# Altium project SolarChargeController.PrjPcb
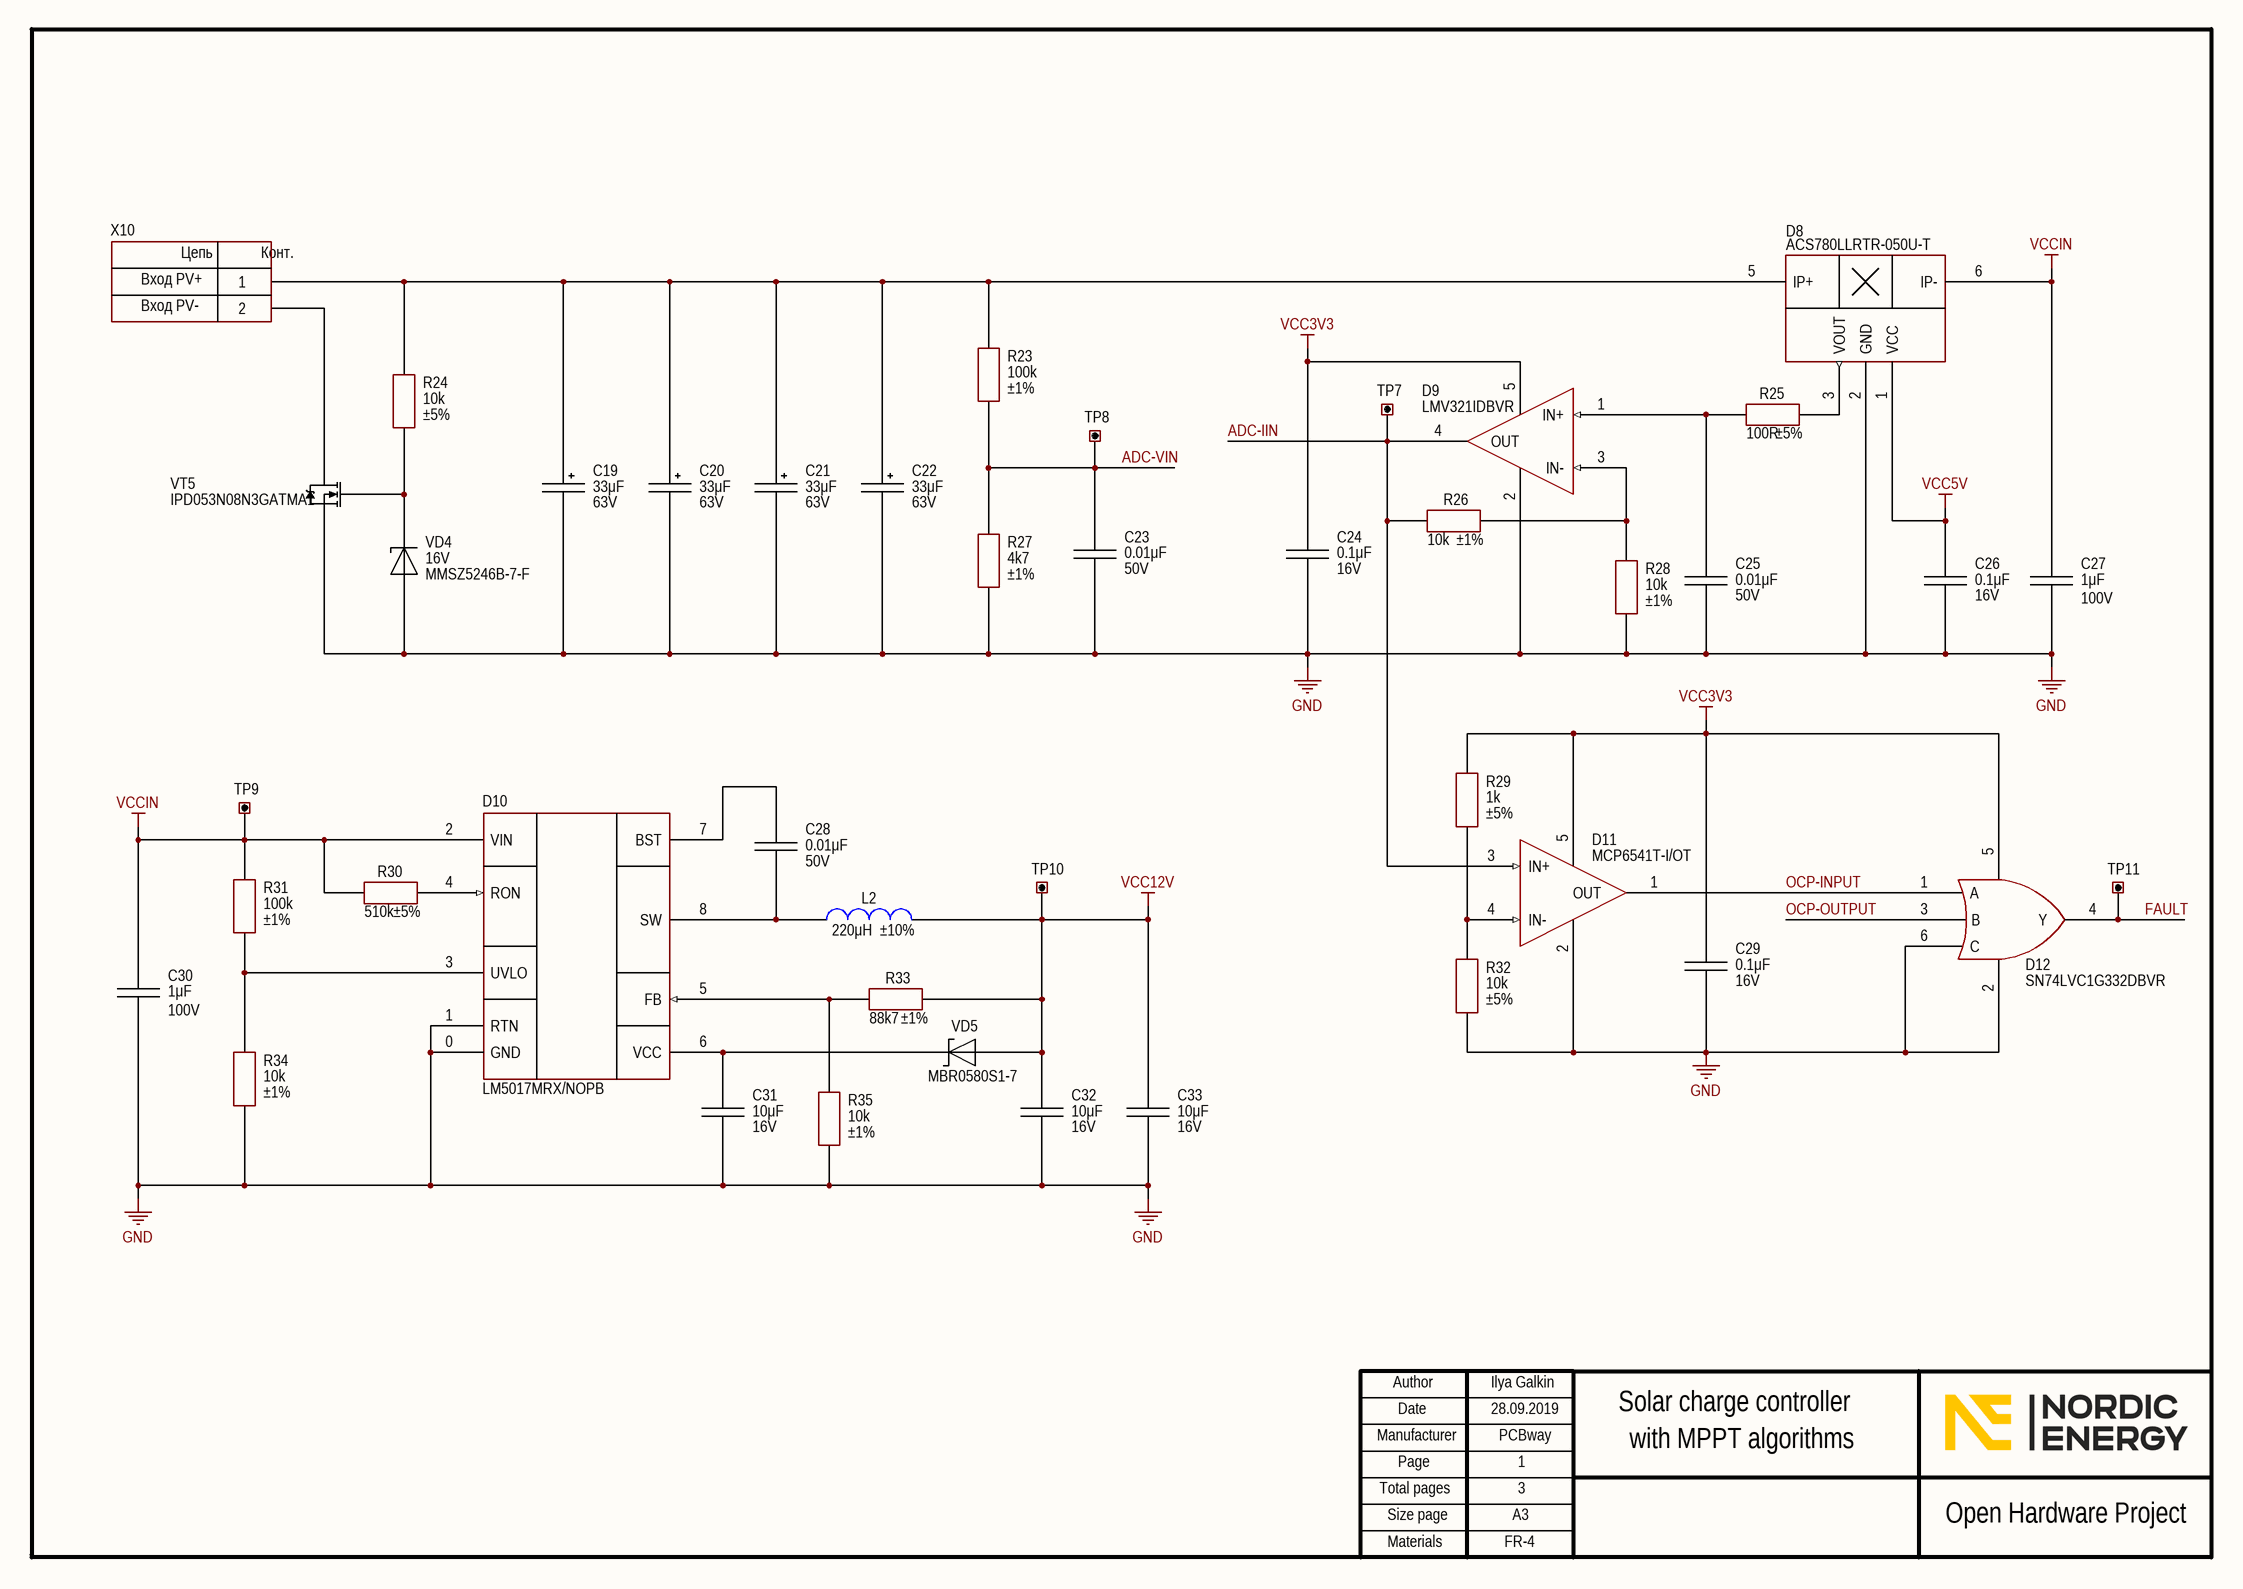
[diagram p0: InputCircuitsAndSupply.SchDoc]
3 sheets, 113 parts. Net scope: global (net labels, ports and power ports of the same name join across sheets).
Board file: PcbForChargeController.PcbDoc
Sheets:
  InputCircuitsAndSupply.SchDoc
  BuckAndOutputCircuits. Page 2.SchDoc
  InterfaceAndControl.SchDoc

## Sheet InputCircuitsAndSupply.SchDoc
size 420 x 297 mm; Address1: Address1; Address2: Address2; Address3: Address3; Address4: Address4; DocumentNumber: АБВГ.123456.001 Э3; SheetNumber: 1; SheetTotal: 3; Scale: 1:1; DocumentType: Схема электрическая принципиальная; FirstReferrence: АБВГ.123456.001

### Parts
C19  value 33μF  Voltage: 63V  [CAP: D8C3.5H12]
C20  value 33μF  Voltage: 63V  [CAP: D8C3.5H12]
C21  value 33μF  Voltage: 63V  [CAP: D8C3.5H12]
C22  value 33μF  Voltage: 63V  [CAP: D8C3.5H12]
C23  value 0.01μF  Voltage: 50V  [CAP: 0805]
C24  value 0.1μF  Voltage: 16V  [CAP: 0805]
C25  value 0.01μF  Voltage: 50V  [CAP: 0805]
C26  value 0.1μF  Voltage: 16V  [CAP: 0805]
C27  value 1μF  Voltage: 100V  [CAP: 1206]
C28  value 0.01μF  Voltage: 50V  [CAP: 0805]
C29  value 0.1μF  Voltage: 16V  [CAP: 0805]
C30  value 1μF  Voltage: 100V  [CAP: 1206]
C31  value 10μF  Voltage: 16V  [CAP: 0805]
C32  value 10μF  Voltage: 16V  [CAP: 0805]
C33  value 10μF  Voltage: 16V  [CAP: 0805]
D8  PartNumber: ACS780LLRTR-050U-T  [SENSOR: ACS781]
D9  (no value)  [SOT23-5]
D10  PartNumber: LM5017MRX/NOPB  [8-SOIC-PAD]
D11  (no value)  [SOT23-5]
D12  (no value)  [SOT23-6]
L2  value 220μH  Tolerance: ±10%  [IND: SDR0805]
R23  value 100k  Tolerance: ±1%  [RES: 0805]
R24  value 10k  Tolerance: ±5%  [RES: 0805]
R25  value 100R  Tolerance: ±5%  [RES: 0805]
R26  value 10k  Tolerance: ±1%  [RES: 0805]
R27  value 4k7  Tolerance: ±1%  [RES: 0805]
R28  value 10k  Tolerance: ±1%  [RES: 0805]
R29  value 1k  Tolerance: ±5%  [RES: 0805]
R30  value 510k  Tolerance: ±5%  [RES: 0805]
R31  value 100k  Tolerance: ±1%  [RES: 0805]
R32  value 10k  Tolerance: ±5%  [RES: 0805]
R33  value 88k7  Tolerance: ±1%  [RES: 0805]
R34  value 10k  Tolerance: ±1%  [RES: 0805]
R35  value 10k  Tolerance: ±1%  [RES: 0805]
TP7  (no value)  [CON: 5004 (Keystone)]
TP8  (no value)  [CON: 5004 (Keystone)]
TP9  (no value)  [CON: 5001 (Keystone)]
TP10  (no value)  [CON: 5001 (Keystone)]
TP11  (no value)  [CON: 5001 (Keystone)]
VD4  Voltage: 16V  PartNumber: MMSZ5246B-7-F  [DIODE: SOD123]
VD5  PartNumber: MBR0580S1-7  [DIODE: SOD123]
VT5  PartNumber: IPD053N08N3GATMA1  [DPAK]
X10  (no value)  [CON: 6PCV-02-006]

### Nets
GND: C19.2 C20.2 C21.2 C22.2 C23.1 C24.1 C25.1 C26.1 C27.1 C29.1 C30.1 C31.1 C32.1 C33.1 D8.2(GND) D9.2(V-) D10.0(GND) D10.1(RTN) D11.2(V-) D12.2 D12.6(C) R27.2 R28.2 R32.2 R34.2 R35.2 VD4.1(A) VT5.2(S)
VCC3V3: C24.2 C29.2 D9.5(V+) D11.5(V+) D12.5 R29.1
VCC5V: C26.2 D8.1(VCC)
VCC12V: C32.2 C33.2 L2.1 R33.2 TP10.1 VD5.1
VCCIN: C27.2 C30.2 D8.6(IP-) D10.2(VIN) R30.1 R31.2 TP9.1
ADC-IIN: D9.4(OUT) D11.3(IN+) R26.1 TP7.1
ADC-VIN: C23.2 R23.2 R27.1 TP8.1
FAULT: D12.4(Y) TP11.1
OCP-INPUT: D11.1(OUT) D12.1(A)
OCP-OUTPUT: D12.3(B)
NetC19_1: C19.1 C20.1 C21.1 C22.1 D8.5(IP+) R23.1 R24.1 X10.1
NetC25_2: C25.2 D9.1(IN+) R25.1
NetC28_1: C28.1 D10.8(SW) L2.2
NetC28_2: C28.2 D10.7(BST)
NetC31_2: C31.2 D10.6(VCC) VD5.2
NetD8_3: D8.3(VOUT) R25.2
NetD9_3: D9.3(IN-) R26.2 R28.1
NetD10_3: D10.3(UVLO) R31.1 R34.1
NetD10_4: D10.4(RON) R30.2
NetD10_5: D10.5(FB) R33.1 R35.1
NetD11_4: D11.4(IN-) R29.2 R32.1
NetR24_2: R24.2 VD4.2(C) VT5.1(G)
NetVT5_3: VT5.3(D) X10.2

### Notes on the sheet
- Вход PV+
- Вход PV-
- Ilya Galkin
- 28.09.2019
- PCBway
- 1
- Solar charge controller
- with MPPT algorithms
- 3
- FR-4
- Author
- Manufacturer
- Date
- Page
- Total pages
- Size page
- A3
- Open Hardware Project
- Materials
- (in symbol Connector_6PCV-02) Цепь; Конт.

### Library data of the parts
C19-C22 = Aluminium: Manufacturer: Panasonic; PartNumber: 63SXE33M; ValueManufacturerPartNumber: Aluminium capacitor, 33μF, 63V, ±20%, 25mOhm, 12x8x3.5 mm, -55...+105°C; TypeCapacitor: Aluminium capacitor; Tolerance: ±20%; Impedance: 25mOhm; Package: 12x8x3.5 mm; HelpURL: https://www.digikey.com/products/en?keywords=%2063SXE33M; Temperature: -55...+105°C
C23 C25 C28 = Ceramic_0805: Manufacturer: Yageo; PartNumber: CC0805KRX7R9BB103; ValueManufacturerPartNumber: Ceramic capacitor, 0.01μF, X7R, ±10%, 50V, 0805, -55...+125°C; TypeCapacitor: Ceramic capacitor; Tolerance: ±10%; TypeDielectric: X7R; Package: 0805; HelpURL: https://www.digikey.com/product-detail/en/yageo/CC0805KRX7R9BB103/311-1136-1-ND/303046; Temperature: -55...+125°C
C24 C26 C29 = Ceramic_0805: Manufacturer: Yageo; PartNumber: CC0805KRX7R7BB104; ValueManufacturerPartNumber: Ceramic capacitor, 0.1μF, X7R, ±10%, 16V, 0805, -55...+125°C; TypeCapacitor: Ceramic capacitor; Tolerance: ±10%; TypeDielectric: X7R; Package: 0805; HelpURL: https://www.digikey.com/product-detail/en/yageo/CC0805KRX7R7BB104/311-1142-1-ND/303052; Temperature: -55...+125°C
C27 C30 = Ceramic_1206: Manufacturer: Samsung; PartNumber: CL31B105KCHNNNE; ValueManufacturerPartNumber: Ceramic capacitor, 1μF, X7R, ±10%, 100V, 1206, -55...+125°C; TypeCapacitor: Ceramic capacitor; Tolerance: ±10%; TypeDielectric: X7R; Package: 1206; HelpURL: https://www.digikey.com/product-detail/en/samsung-electro-mechanics/CL31B105KCHNNNE/1276-1838-1-ND/3889924; Temperature: -55...+125°C
C31-C33 = Ceramic_0805: Manufacturer: Samsung; PartNumber: CL21B106KOQNNNG; ValueManufacturerPartNumber: Ceramic capacitor, 10μF, X7R, ±10%, 16V, 0805, -55...+125°C; TypeCapacitor: Ceramic capacitor; Tolerance: ±10%; TypeDielectric: X7R; Package: 0805; HelpURL: https://www.digikey.com/product-detail/en/samsung-electro-mechanics/CL21B106KOQNNNG/1276-6472-1-ND/5958100; Temperature: -55...+125°C
D8 = ACS780: Current sensors; Manufacturer: Allegro MicroSystems; ValueManufacturerPartNumber: IC current sensors, 50A, ±1.5%, 120 kHz, 60mV/A, -40...+150°C, 7-PSOF; Supply: 4.5...5.5V; Accuracy: ±1.5%; GainBandwidth: 120 kHz; Sensitivity: 60mV/A; Sensing: 50A; HelpURL: https://www.digikey.com/product-detail/en/allegro-microsystems-llc/ACS780LLRTR-050U-T/620-1818-1-ND/6189107; Package: 7-PSOF; ComponentType: IC current sensors; Temperature: -40...+150°C
D9 = LMV321IDBVR: OP amplifier; Manufacturer: Texas Instruments; ValueManufacturerPartNumber: IC op amplifier, Rail-to-Rail, 1 MHz, 2.7...5.5V, -40...+125°C, SOT23-5; Supply: 2.7...5.5V; OutputType: Rail-to-Rail; GainBandwidth: 1 MHz; HelpURL: https://www.digikey.com/product-detail/en/texas-instruments/LMV321IDBVR/296-9567-1-ND/379849; Package: SOT23-5; ComponentType: IC op amplifier; Temperature: -40...+125°C; PartNumber: LMV321IDBVR
D10 = LM5017MRX: Buck converter; Manufacturer: Texas Instruments; ValueManufacturerPartNumber: DC/DC buck converter, input 7.5...100V, 1MHz, output 1.225...90V, 0.6A, -40...+125°C, 8-SOIC; VoltageInput: input 7.5...100V; Frequency: 1MHz; CurrentOutput: 0.6A; VoltageOutput: output 1.225...90V; HelpURL: https://www.digikey.com/product-detail/en/texas-instruments/LM5017SD-NOPB/LM5017SD-NOPBCT-ND/3137455; Package: 8-SOIC; ComponentType: DC/DC buck converter; Temperature: -40...+125°C
D11 = MCP6541T-I/OT: Comparator; Manufacturer: Microchip Technology; ValueManufacturerPartNumber: IC comparator, Rail-to-Rail, 1.6...5.5V, -40...+85°C, SOT23-5; Supply: 1.6...5.5V; OutputType: Rail-to-Rail; HelpURL: https://www.digikey.com/product-detail/en/microchip-technology/MCP6541T-I-OT/MCP6541T-I-OTCT-ND/3622387; Package: SOT23-5; ComponentType: IC comparator; Temperature: -40...+85°C; PartNumber: MCP6541T-I/OT
D12 = SN74LVC1G332DBVR: OR; Manufacturer: Texas Instruments; ValueManufacturerPartNumber: IC logic OR, 1.65...5.5V, -40...+125°C, SOT23-6; Supply: 1.65...5.5V; HelpURL: https://www.digikey.com/product-detail/en/texas-instruments/SN74LVC1G332DBVR/296-18587-1-ND/857355; Package: SOT23-6; ComponentType: IC logic OR; Temperature: -40...+125°C; PartNumber: SN74LVC1G332DBVR
L2 = Inductor_SDR0805: Manufacturer: Bourns; PartNumber: SDR0805-221KL; ValueManufacturerPartNumber: Fixed inductor, 220μH, ±10%, SDR0805, 490mA, -40...+125°C; TypeInductor: Fixed inductor; MaxCurrent: 490mA; Package: SDR0805; HelpURL: https://www.digikey.com/product-detail/en/bourns-inc/SDR0805-221KL/SDR0805-221KLCT-ND/2127164; Temperature: -40...+125°C
R23 R31 = Resistor_0805: Manufacturer: Yageo; PartNumber: RC0805FR-07100KL; ValueManufacturerPartNumber: Resistor film, 100k, ±1%, 0805, 0.125W, -55...+125°C; TypeResistor: Resistor film; Power: 0.125W; Package: 0805; HelpURL: https://www.digikey.com/product-detail/en/yageo/RC0805FR-07100KL/311-100KCRCT-ND/730491; Temperature: -55...+125°C
R24 R32 = Resistor_0805: Manufacturer: Yageo; PartNumber: RC0805JR-0710KL; ValueManufacturerPartNumber: Resistor film, 10k, ±5%, 0805, 0.125W, -55...+125°C; TypeResistor: Resistor film; Power: 0.125W; Package: 0805; HelpURL: https://www.digikey.com/product-detail/en/yageo/RC0805JR-0710KL/311-10KARCT-ND/731188; Temperature: -55...+125°C
R25 = Resistor_0805: Manufacturer: Yageo; PartNumber: RC0805JR-07100RL; ValueManufacturerPartNumber: Resistor film, 100R, ±5%, 0805, 0.125W, -55...+125°C; TypeResistor: Resistor film; Power: 0.125W; Package: 0805; HelpURL: https://www.digikey.com/product-detail/en/yageo/RC0805JR-07100RL/311-100ARCT-ND/731185; Temperature: -55...+125°C
R26 R28 R34 R35 = Resistor_0805: Manufacturer: Yageo; PartNumber: RC0805FR-0710KL; ValueManufacturerPartNumber: Resistor film, 10k, ±1%, 0805, 0.125W, -55...+125°C; TypeResistor: Resistor film; Power: 0.125W; Package: 0805; HelpURL: https://www.digikey.com/product-detail/en/yageo/RC0805FR-0710KL/311-10.0KCRCT-ND/730482; Temperature: -55...+125°C
R27 = Resistor_0805: Manufacturer: Yageo; PartNumber: RC0805FR-074K7L; ValueManufacturerPartNumber: Resistor film, 4k7, ±1%, 0805, 0.125W, -55...+125°C; TypeResistor: Resistor film; Power: 0.125W; Package: 0805; HelpURL: https://www.digikey.com/product-detail/en/yageo/RC0805FR-074K7L/311-4.70KCRCT-ND/730876; Temperature: -55...+125°C
R29 = Resistor_0805: Manufacturer: Yageo; PartNumber: RC0805JR-071KL; ValueManufacturerPartNumber: Resistor film, 1k, ±5%, 0805, 0.125W, -55...+125°C; TypeResistor: Resistor film; Power: 0.125W; Package: 0805; HelpURL: https://www.digikey.com/product-detail/en/yageo/RC0805JR-071KL/311-1.0KARCT-ND/731165; Temperature: -55...+125°C
R30 = Resistor_0805: Manufacturer: Yageo; PartNumber: RC0805JR-07510KL; ValueManufacturerPartNumber: Resistor film, 510k, ±5%, 0805, 0.125W, -55...+125°C; TypeResistor: Resistor film; Power: 0.125W; Package: 0805; HelpURL: https://www.digikey.com/product-detail/en/yageo/RC0805JR-07510KL/311-510KARCT-ND/731291; Temperature: -55...+125°C
R33 = Resistor_0805: Manufacturer: Yageo; PartNumber: RC0805FR-0788K7L; ValueManufacturerPartNumber: Resistor film, 88k7, ±1%, 0805, 0.125W, -55...+125°C; TypeResistor: Resistor film; Power: 0.125W; Package: 0805; HelpURL: https://www.digikey.com/product-detail/en/yageo/RC0805FR-0788K7L/311-88.7KCRCT-ND/731128; Temperature: -55...+125°C
TP7-TP11 = Connector_Test_Point: Manufacturer: Keystone; ValueManufacturerPartNumber: Test point, Keystone, 5001; PartNumber: 5001; TypeConnector: Test point; HelpURL: https://www.digikey.com/product-detail/en/keystone-electronics/5001/36-5001-ND/255327
VD4 = Zener_single: Manufacturer: Diodes Incorporated; ValueManufacturerPartNumber: Zener diode, 16V, 500mW, 0.9V, 17Ohm, SOD-123, -65...+150°C; TypeDiode: Zener diode; Current: 500mW; VoltageDrop: 0.9V; RecoveryTime: 17Ohm; Package: SOD-123; HelpURL: https://www.digikey.com/product-detail/en/diodes-incorporated/MMSZ5246B-7-F/MMSZ5246B-FDICT-ND/717912; Temperature: -65...+150°C
VD5 = Schottky_single: Manufacturer: Diodes Incorporated; ValueManufacturerPartNumber: Schottky diode, 80V, 500mA, 1V, 15pF, SOD-123, -55...+150°C; TypeDiode: Schottky diode; Voltage: 80V; Current: 500mA; VoltageDrop: 1V; RecoveryTime: 15pF; Package: SOD-123; HelpURL: https://www.digikey.com/product-detail/en/diodes-incorporated/MBR0580S1-7/MBR0580S1-7DICT-ND/5080371; Temperature: -55...+150°C
VT5 = MOSFET_N_132: Manufacturer: Infineon Technologies; ValueManufacturerPartNumber: MOSFET N-channel transistor, 80V, 90A, 69nC, 150W, 5.3mOhm, 4750pF, Dpak, -55...+150°C; TypeTransistor: MOSFET N-channel transistor; VoltageDS: 80V; CurrentDS: 90A; RDS: 5.3mOhm; GateCharge: 69nC; InputCapacitor: 4750pF; MaxPower: 150W; Package: Dpak; HelpURL: https://www.digikey.com/product-detail/en/infineon-technologies/IPD053N08N3GATMA1/IPD053N08N3GATMA1CT-ND/5353500; Temperature: -55...+150°C
X10 = Connector_6PCV-02: Manufacturer: TE Connectivity; ValueManufacturerPartNumber: Connector, 2pin, 9.53mm, 300VAC, 25A; PartNumber: 6PCV-02-006; VoltageMax: 300VAC; Pitch: 9.53mm; CurrentMax: 25A; Multichannel: 2pin; CommentText: "Solar panel"; HelpURL: https://www.digikey.com/products/en?keywords=6PCV-02-006; TypeConnector: Connector

## Sheet BuckAndOutputCircuits. Page 2.SchDoc
size 420 x 297 mm; Address1: Address1; Address2: Address2; Address3: Address3; Address4: Address4; DocumentNumber: АБВГ.123456.001 Э3; SheetNumber: 2; SheetTotal: 3; Scale: 1:1; DocumentType: Схема электрическая принципиальная; FirstReferrence: АБВГ.123456.001
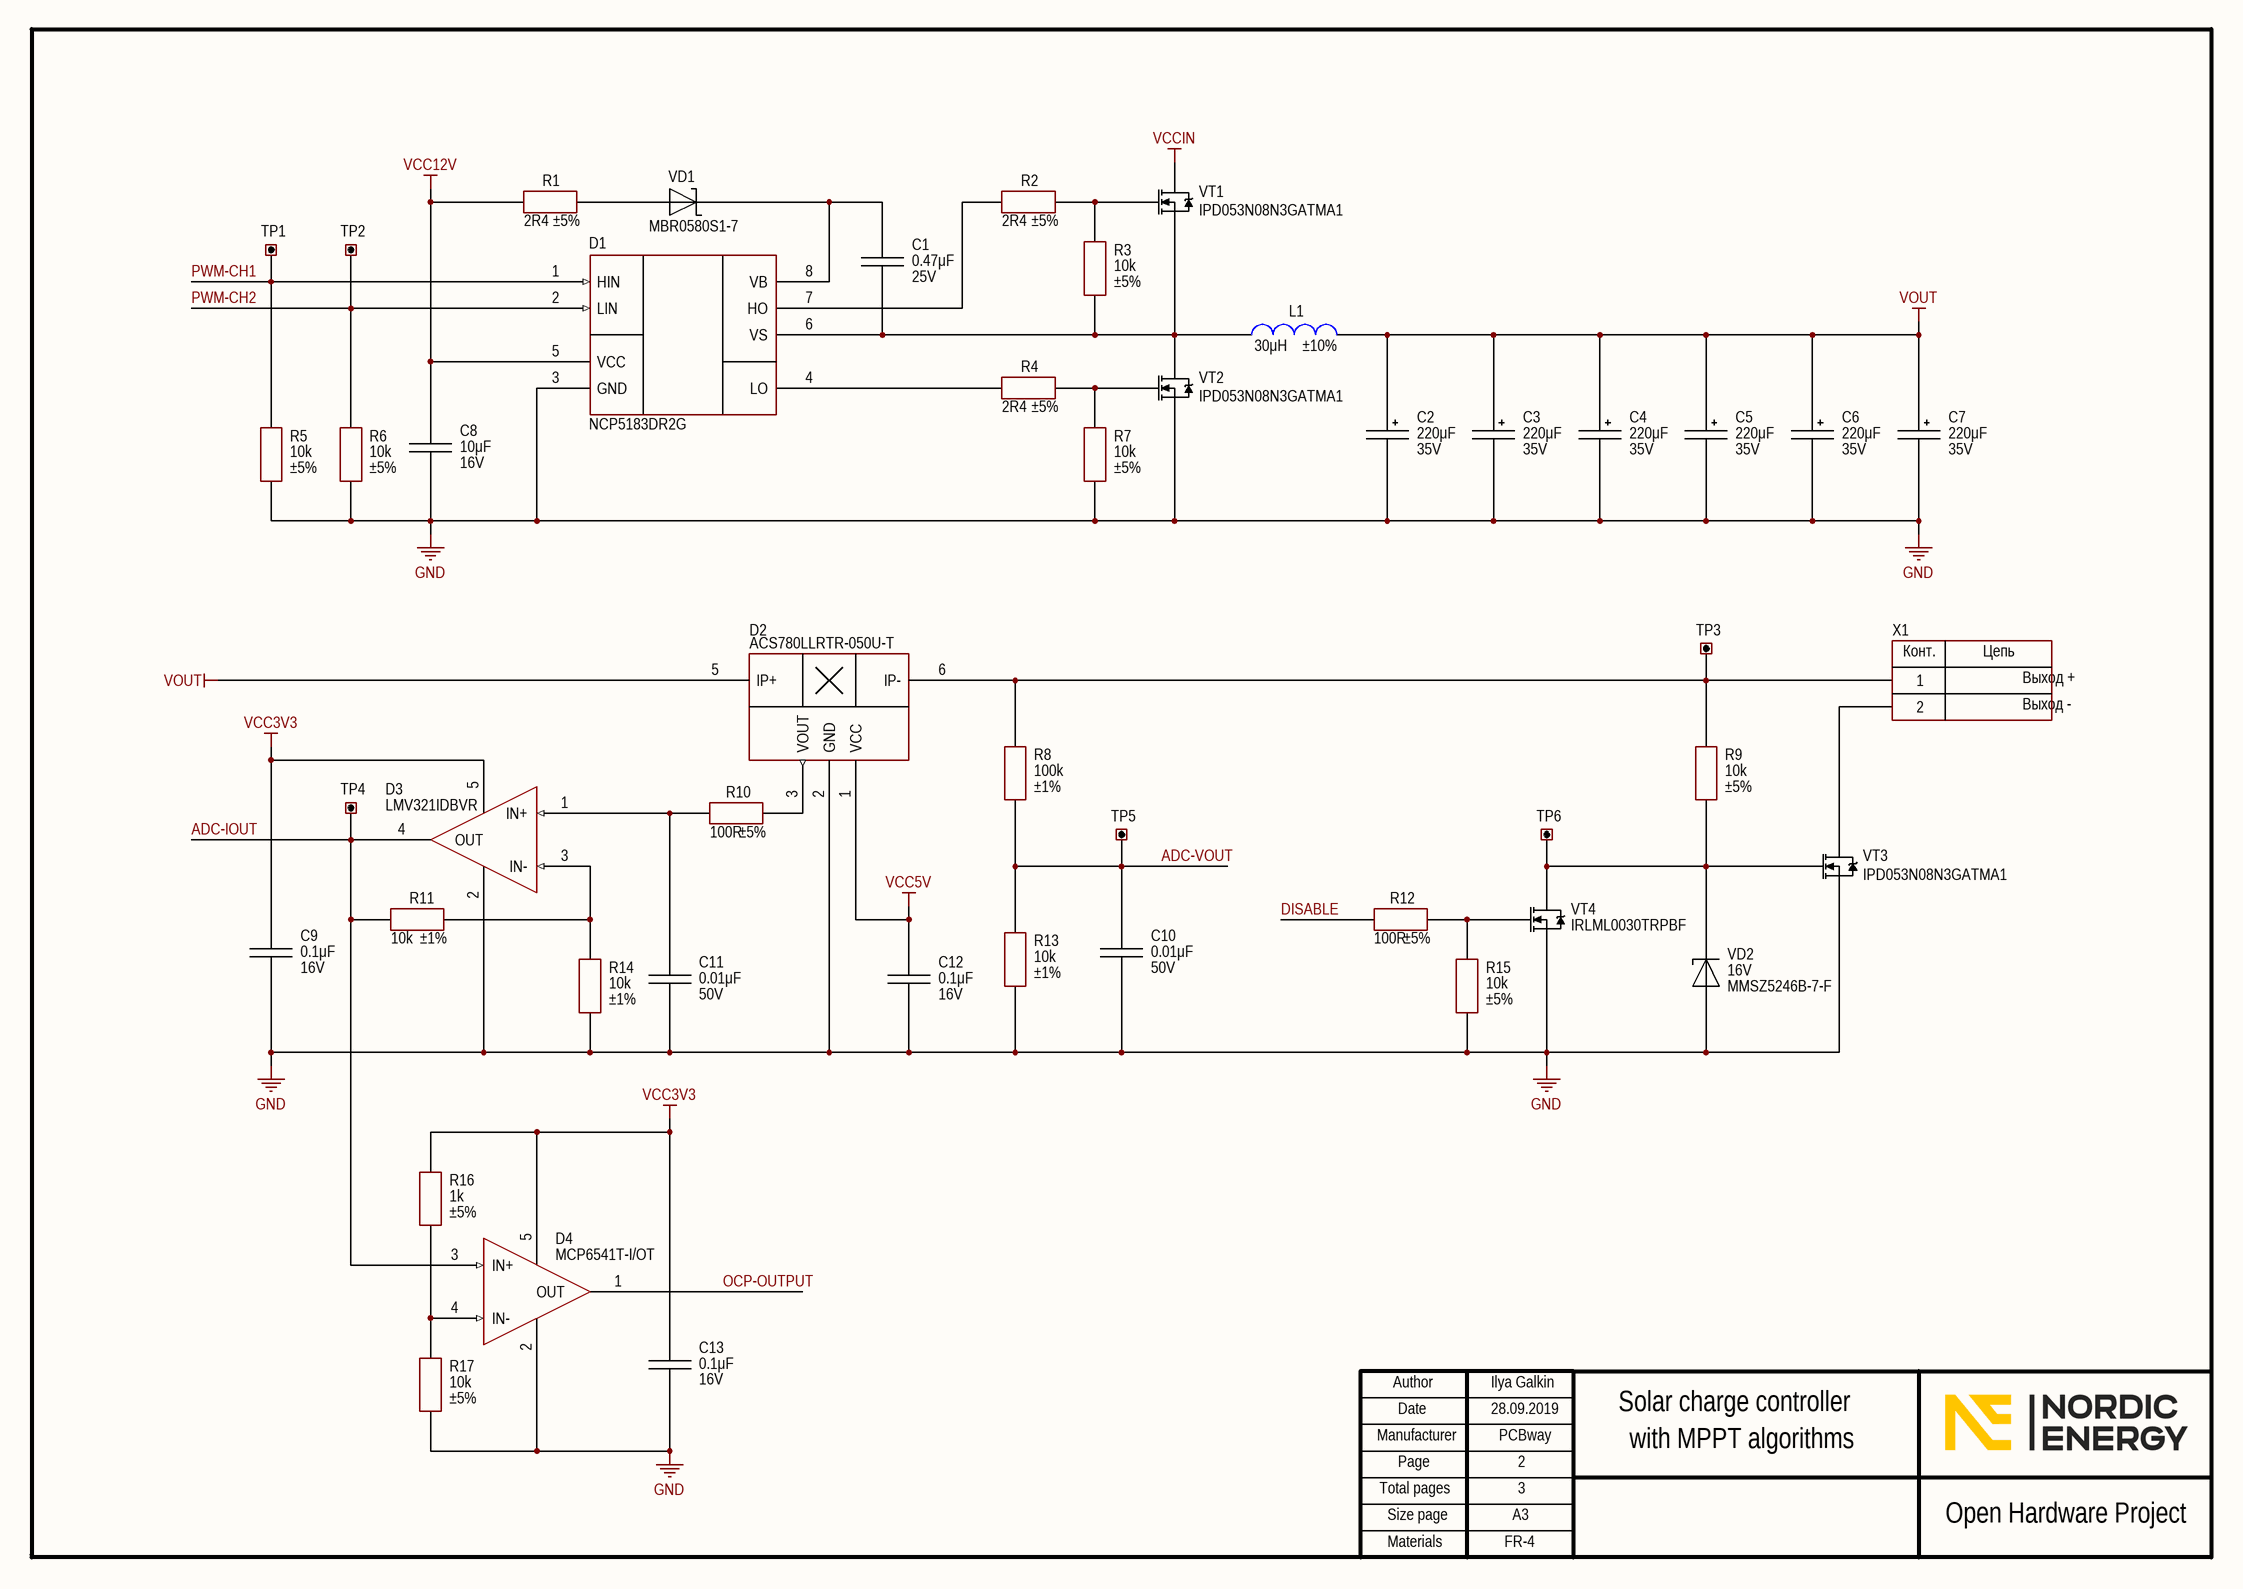
[diagram p1: BuckAndOutputCircuits. Page 2.SchDoc]

### Parts
C1  value 0.47μF  Voltage: 25V  [CAP: 0805]
C2  value 220μF  Voltage: 35V  [CAP: D6.3C2.5H11]
C3  value 220μF  Voltage: 35V  [CAP: D6.3C2.5H11]
C4  value 220μF  Voltage: 35V  [CAP: D6.3C2.5H11]
C5  value 220μF  Voltage: 35V  [CAP: D6.3C2.5H11]
C6  value 220μF  Voltage: 35V  [CAP: D6.3C2.5H11]
C7  value 220μF  Voltage: 35V  [CAP: D6.3C2.5H11]
C8  value 10μF  Voltage: 16V  [CAP: 0805]
C9  value 0.1μF  Voltage: 16V  [CAP: 0805]
C10  value 0.01μF  Voltage: 50V  [CAP: 0805]
C11  value 0.01μF  Voltage: 50V  [CAP: 0805]
C12  value 0.1μF  Voltage: 16V  [CAP: 0805]
C13  value 0.1μF  Voltage: 16V  [CAP: 0805]
D1  (no value)  [8-SOIC]
D2  PartNumber: ACS780LLRTR-050U-T  [SENSOR: ACS781]
D3  (no value)  [SOT23-5]
D4  (no value)  [SOT23-5]
L1  value 30μH  Tolerance: ±10%  [IND: R32.8/20.1/10.7 (L)]
R1  value 2R4  Tolerance: ±5%  [RES: 0805]
R2  value 2R4  Tolerance: ±5%  [RES: 0805]
R3  value 10k  Tolerance: ±5%  [RES: 0805]
R4  value 2R4  Tolerance: ±5%  [RES: 0805]
R5  value 10k  Tolerance: ±5%  [RES: 0805]
R6  value 10k  Tolerance: ±5%  [RES: 0805]
R7  value 10k  Tolerance: ±5%  [RES: 0805]
R8  value 100k  Tolerance: ±1%  [RES: 0805]
R9  value 10k  Tolerance: ±5%  [RES: 0805]
R10  value 100R  Tolerance: ±5%  [RES: 0805]
R11  value 10k  Tolerance: ±1%  [RES: 0805]
R12  value 100R  Tolerance: ±5%  [RES: 0805]
R13  value 10k  Tolerance: ±1%  [RES: 0805]
R14  value 10k  Tolerance: ±1%  [RES: 0805]
R15  value 10k  Tolerance: ±5%  [RES: 0805]
R16  value 1k  Tolerance: ±5%  [RES: 0805]
R17  value 10k  Tolerance: ±5%  [RES: 0805]
TP1  (no value)  [CON: 5001 (Keystone)]
TP2  (no value)  [CON: 5001 (Keystone)]
TP3  (no value)  [CON: 5001 (Keystone)]
TP4  (no value)  [CON: 5004 (Keystone)]
TP5  (no value)  [CON: 5004 (Keystone)]
TP6  (no value)  [CON: 5001 (Keystone)]
VD1  PartNumber: MBR0580S1-7  [DIODE: SOD123]
VD2  Voltage: 16V  PartNumber: MMSZ5246B-7-F  [DIODE: SOD123]
VT1  PartNumber: IPD053N08N3GATMA1  [DPAK]
VT2  PartNumber: IPD053N08N3GATMA1  [DPAK]
VT3  PartNumber: IPD053N08N3GATMA1  [DPAK]
VT4  PartNumber: IRLML0030TRPBF  [SOT23]
X1  (no value)  [CON: 6PCV-02-006]

### Nets
GND: C2.2 C3.2 C4.2 C5.2 C6.2 C7.2 C8.1 C9.1 C10.1 C11.1 C12.1 C13.1 D1.3(GND) D2.2(GND) D3.2(V-) D4.2(V-) R5.2 R6.2 R7.2 R13.2 R14.2 R15.2 R17.2 VD2.1(A) VT2.2(S) VT3.2(S) VT4.2(S)
VCC3V3: C9.2 C13.2 D3.5(V+) D4.5(V+) R16.1
VCC5V: C12.2 D2.1(VCC)
VCC12V: C8.2 D1.5(VCC) R1.1
VCCIN: VT1.3(D)
VOUT: C2.1 C3.1 C4.1 C5.1 C6.1 C7.1 D2.5(IP+) L1.1
ADC-IOUT: D3.4(OUT) D4.3(IN+) R11.1 TP4.1
ADC-VOUT: C10.2 R8.2 R13.1 TP5.1
DISABLE: R12.1
OCP-OUTPUT: D4.1(OUT)
PWM-CH1: D1.1(HIN) R5.1 TP1.1
PWM-CH2: D1.2(LIN) R6.1 TP2.1
NetC1_1: C1.1 D1.6(VS) L1.2 R3.2 VT1.2(S) VT2.3(D)
NetC1_2: C1.2 D1.8(VB) VD1.2
NetC11_2: C11.2 D3.1(IN+) R10.1
NetD1_4: D1.4(LO) R4.1
NetD1_7: D1.7(HO) R2.1
NetD2_3: D2.3(VOUT) R10.2
NetD2_6: D2.6(IP-) R8.1 R9.1 TP3.1 X1.1
NetD3_3: D3.3(IN-) R11.2 R14.1
NetD4_4: D4.4(IN-) R16.2 R17.1
NetR1_2: R1.2 VD1.1
NetR2_2: R2.2 R3.1 VT1.1(G)
NetR4_2: R4.2 R7.1 VT2.1(G)
NetR9_2: R9.2 TP6.1 VD2.2(C) VT3.1(G) VT4.3(D)
NetR12_2: R12.2 R15.1 VT4.1(G)
NetVT3_3: VT3.3(D) X1.2

### Notes on the sheet
- Выход +
- Выход -
- Ilya Galkin
- 28.09.2019
- PCBway
- 2
- Solar charge controller
- with MPPT algorithms
- 3
- FR-4
- Author
- Manufacturer
- Date
- Page
- Total pages
- Size page
- A3
- Open Hardware Project
- Materials
- (in symbol Connector_6PCV-02) Конт.; Цепь

### Library data of the parts
C1 = Ceramic_0805: Manufacturer: Yageo; PartNumber: CC0805KKX7R8BB474; ValueManufacturerPartNumber: Ceramic capacitor, 0.47μF, X7R, ±10%, 25V, 0805, -55...+125°C; TypeCapacitor: Ceramic capacitor; Tolerance: ±10%; TypeDielectric: X7R; Package: 0805; HelpURL: https://www.digikey.com/product-detail/en/yageo/CC0805KKX7R8BB474/311-1364-1-ND/2103148; Temperature: -55...+125°C
C2-C7 = Aluminium: Manufacturer: Aihua Group; PartNumber: SPZ1VM221E12O00; ValueManufacturerPartNumber: Aluminium polymer capacitor, 220μF, 35V, ±20%, 30mOhm, 12x6.3x2.5 mm, -55...+105°C; TypeCapacitor: Aluminium polymer capacitor; Tolerance: ±20%; Impedance: 30mOhm; Package: 12x6.3x2.5 mm; HelpURL: https://lcsc.com/product-detail/Solid-Polymer-Electrolytic-Capacitor_220uF-35V_C171433.html; Temperature: -55...+105°C
C8 = Ceramic_0805: as C31 on sheet InputCircuitsAndSupply; Package: 0805; HelpURL: https://www.digikey.com/product-detail/en/samsung-electro-mechanics/CL21B106KOQNNNG/1276-6472-1-ND/5958100; Temperature: -55...+125°C
C9 C12 C13 = Ceramic_0805: as C24 on sheet InputCircuitsAndSupply; Package: 0805; HelpURL: https://www.digikey.com/product-detail/en/yageo/CC0805KRX7R7BB104/311-1142-1-ND/303052; Temperature: -55...+125°C
C10 C11 = Ceramic_0805: as C23 on sheet InputCircuitsAndSupply; Package: 0805; HelpURL: https://www.digikey.com/product-detail/en/yageo/CC0805KRX7R9BB103/311-1136-1-ND/303046; Temperature: -55...+125°C
D1 = NCP5183DR2G: Gate driver; Manufacturer: ON Semiconductor; ValueManufacturerPartNumber: Half-bridge gate driver, 600V, 500kHz, ±4.3A, supply 9...18V, -40...+125°C, 8-SOIC; VoltageSupply: supply 9...18V; Frequency: 500kHz; CurrentOutput: ±4.3A; VoltageWork: 600V; HelpURL: https://www.digikey.com/product-detail/en/on-semiconductor/NCP5183DR2G/NCP5183DR2GOSCT-ND/7066807; Package: 8-SOIC; ComponentType: Half-bridge gate driver; Temperature: -40...+125°C; PartNumber: NCP5183DR2G
D2 = ACS780: as D8 on sheet InputCircuitsAndSupply; HelpURL: https://www.digikey.com/product-detail/en/allegro-microsystems-llc/ACS780LLRTR-050U-T/620-1818-1-ND/6189107; Package: 7-PSOF; ComponentType: IC current sensors; Temperature: -40...+150°C
D3 = LMV321IDBVR: as D9 on sheet InputCircuitsAndSupply; HelpURL: https://www.digikey.com/product-detail/en/texas-instruments/LMV321IDBVR/296-9567-1-ND/379849; Package: SOT23-5; ComponentType: IC op amplifier; Temperature: -40...+125°C; PartNumber: LMV321IDBVR
D4 = MCP6541T-I/OT: as D11 on sheet InputCircuitsAndSupply; HelpURL: https://www.digikey.com/product-detail/en/microchip-technology/MCP6541T-I-OT/MCP6541T-I-OTCT-ND/3622387; Package: SOT23-5; ComponentType: IC comparator; Temperature: -40...+85°C; PartNumber: MCP6541T-I/OT
L1 = Inductor_R32.8/20.1/10.7: Manufacturer: Magnetics; PartNumber: 0077548A7; ValueManufacturerPartNumber: Fixed inductor, 30μH, ±10%, R32.8/20.1/10.7, Kool Mu, µ=125, 127 нГн/витков2; TypeInductor: Fixed inductor; TypeMatiriel: Kool Mu; AL: 127 нГн/витков2; MaterialPermeability: µ=125; Package: R32.8/20.1/10.7; HelpURL: http://ferrite.ru/warehouse/r-32-820-110-7-77548-a7.html
R1 R2 R4 = Resistor_0805: Manufacturer: Yageo; PartNumber: RC0805JR-072R4L; ValueManufacturerPartNumber: Resistor film, 2R4, ±5%, 0805, 0.125W, -55...+125°C; TypeResistor: Resistor film; Power: 0.125W; Package: 0805; HelpURL: https://www.digikey.com/product-detail/en/yageo/RC0805JR-072R4L/311-2.4ARCT-ND/731220; Temperature: -55...+125°C
R3 R5-R7 R9 R15 R17 = Resistor_0805: as R24 on sheet InputCircuitsAndSupply; Package: 0805; HelpURL: https://www.digikey.com/product-detail/en/yageo/RC0805JR-0710KL/311-10KARCT-ND/731188; Temperature: -55...+125°C
R8 = Resistor_0805: as R23 on sheet InputCircuitsAndSupply; Package: 0805; HelpURL: https://www.digikey.com/product-detail/en/yageo/RC0805FR-07100KL/311-100KCRCT-ND/730491; Temperature: -55...+125°C
R10 R12 = Resistor_0805: as R25 on sheet InputCircuitsAndSupply; Package: 0805; HelpURL: https://www.digikey.com/product-detail/en/yageo/RC0805JR-07100RL/311-100ARCT-ND/731185; Temperature: -55...+125°C
R11 R13 R14 = Resistor_0805: as R26 on sheet InputCircuitsAndSupply; Package: 0805; HelpURL: https://www.digikey.com/product-detail/en/yageo/RC0805FR-0710KL/311-10.0KCRCT-ND/730482; Temperature: -55...+125°C
R16 = Resistor_0805: as R29 on sheet InputCircuitsAndSupply; Package: 0805; HelpURL: https://www.digikey.com/product-detail/en/yageo/RC0805JR-071KL/311-1.0KARCT-ND/731165; Temperature: -55...+125°C
TP1-TP6 = Connector_Test_Point: as TP7 on sheet InputCircuitsAndSupply; HelpURL: https://www.digikey.com/product-detail/en/keystone-electronics/5001/36-5001-ND/255327
VD1 = Schottky_single: as VD5 on sheet InputCircuitsAndSupply; Package: SOD-123; HelpURL: https://www.digikey.com/product-detail/en/diodes-incorporated/MBR0580S1-7/MBR0580S1-7DICT-ND/5080371; Temperature: -55...+150°C
VD2 = Zener_single: as VD4 on sheet InputCircuitsAndSupply; Package: SOD-123; HelpURL: https://www.digikey.com/product-detail/en/diodes-incorporated/MMSZ5246B-7-F/MMSZ5246B-FDICT-ND/717912; Temperature: -65...+150°C
VT1-VT3 = MOSFET_N_132: as VT5 on sheet InputCircuitsAndSupply; Package: Dpak; HelpURL: https://www.digikey.com/product-detail/en/infineon-technologies/IPD053N08N3GATMA1/IPD053N08N3GATMA1CT-ND/5353500; Temperature: -55...+150°C
VT4 = MOSFET_N_132: Manufacturer: Infineon Technologies; ValueManufacturerPartNumber: MOSFET N-channel transistor, 30V, 5.3A, 2.6nC, 2.5W, 27mOhm, 382pF, SOT-23, -55...+150°C; TypeTransistor: MOSFET N-channel transistor; VoltageDS: 30V; CurrentDS: 5.3A; RDS: 27mOhm; GateCharge: 2.6nC; InputCapacitor: 382pF; MaxPower: 2.5W; Package: SOT-23; HelpURL: https://www.digikey.com/product-detail/en/infineon-technologies/IRLML0030TRPBF/IRLML0030TRPBFCT-ND/2202231; Temperature: -55...+150°C
X1 = Connector_6PCV-02: as X10 on sheet InputCircuitsAndSupply; HelpURL: https://www.digikey.com/products/en?keywords=6PCV-02-006; TypeConnector: Connector

## Sheet InterfaceAndControl.SchDoc
size 420 x 297 mm; Address1: Address1; Address2: Address2; Address3: Address3; Address4: Address4; DocumentNumber: АБВГ.123456.001 Э3; SheetNumber: 3; SheetTotal: 3; Scale: 1:1; DocumentType: Схема электрическая принципиальная; FirstReferrence: АБВГ.123456.001
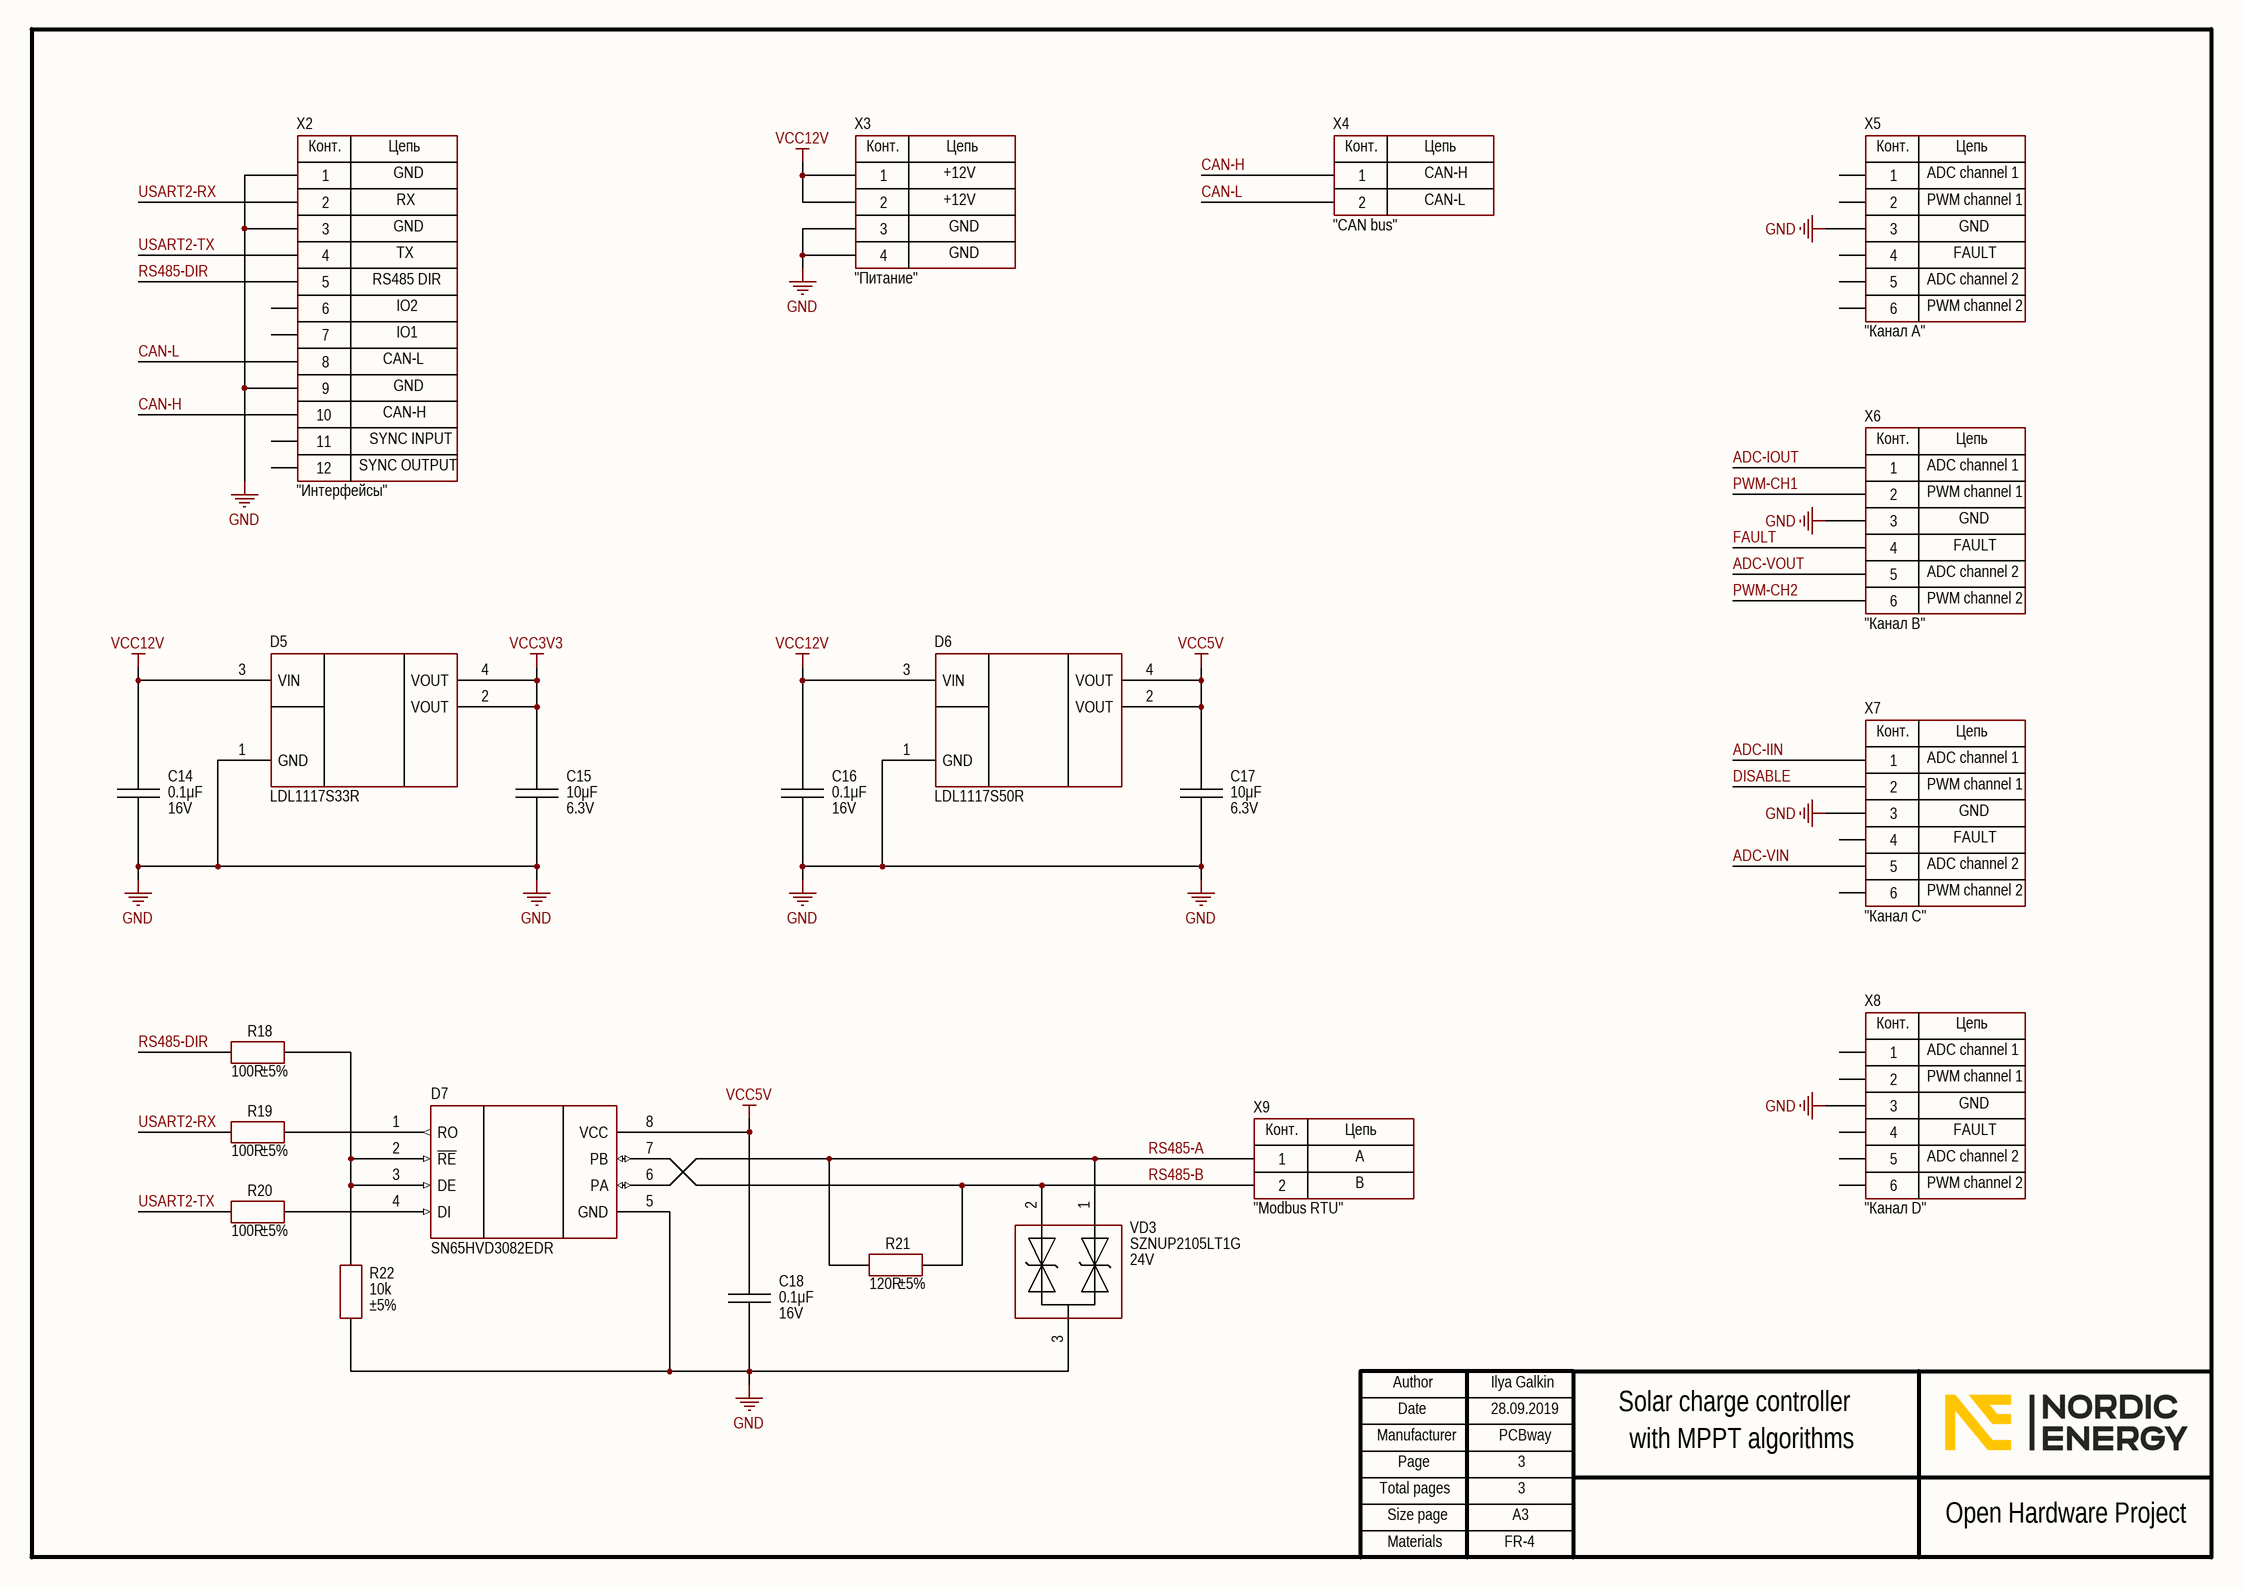
[diagram p2: InterfaceAndControl.SchDoc]

### Parts
C14  value 0.1μF  Voltage: 16V  [CAP: 0805]
C15  value 10μF  Voltage: 6.3V  [CAP: 0805]
C16  value 0.1μF  Voltage: 16V  [CAP: 0805]
C17  value 10μF  Voltage: 6.3V  [CAP: 0805]
C18  value 0.1μF  Voltage: 16V  [CAP: 0805]
D5  (no value)  [SOT223]
D6  PartNumber: LDL1117S50R  [SOT223]
D7  (no value)  [8-SOIC]
R18  value 100R  Tolerance: ±5%  [RES: 0805]
R19  value 100R  Tolerance: ±5%  [RES: 0805]
R20  value 100R  Tolerance: ±5%  [RES: 0805]
R21  value 120R  Tolerance: ±5%  [RES: 0805]
R22  value 10k  Tolerance: ±5%  [RES: 0805]
VD3  Voltage: 24V  PartNumber: SZNUP2105LT1G  [SOT23]
X2  CommentText: "Интерфейсы"  [CON: PBD-12]
X3  CommentText: "Питание"  [CON: PBD-4]
X4  CommentText: "CAN bus"  [CON: DG350-3.5-02P]
X5  CommentText: "Канал А"  [CON: PBD-6]
X6  CommentText: "Канал В"  [CON: PBD-6]
X7  CommentText: "Канал С"  [CON: PBD-6]
X8  CommentText: "Канал D"  [CON: PBD-6]
X9  CommentText: "Modbus RTU"  [CON: DG350-3.5-02P]

### Nets
GND: C14.1 C15.1 C16.1 C17.1 C18.1 D5.1(GND) D6.1(GND) D7.5(GND) R22.2 VD3.3 X2.1 X2.3 X2.9 X3.3 X3.4 X5.3 X6.3 X7.3 X8.3
VCC3V3: C15.2 D5.2(VOUT) D5.4(VOUT)
VCC5V: C17.2 C18.2 D6.2(VOUT) D6.4(VOUT) D7.8(VCC)
VCC12V: C14.2 C16.2 D5.3(VIN) D6.3(VIN) X3.1 X3.2
ADC-IIN: X7.1
ADC-IOUT: X6.1
ADC-VIN: X7.5
ADC-VOUT: X6.5
CAN-H: X2.10 X4.1
CAN-L: X2.8 X4.2
DISABLE: X7.2
FAULT: X6.4
PWM-CH1: X6.2
PWM-CH2: X6.6
RS485-A: D7.6(PA) R21.1 VD3.1 X9.1
RS485-B: D7.7(PB) R21.2 VD3.2 X9.2
RS485-DIR: R18.1 X2.5
USART2-RX: R19.1 X2.2
USART2-TX: R20.1 X2.4
NetD7_1: D7.1(RO) R19.2
NetD7_2: D7.2(~{RE}) D7.3(DE) R18.2 R22.1
NetD7_4: D7.4(DI) R20.2

Not connected (* = marked no-connect by the designer): X2 6 7 11 12; X5 1 2 4 5 6; X7 4 6; X8 1 2 4 5 6

### Notes on the sheet
- GND
- +12V
- CAN-H
- ADC channel 1
- TX
- RX
- CAN-L
- PWM channel 1
- FAULT
- RS485 DIR
- IO2
- ADC channel 2
- PWM channel 2
- IO1
- SYNC INPUT
- SYNC OUTPUT
- B
- A
- Ilya Galkin
- 28.09.2019
- PCBway
- 3
- Solar charge controller
- with MPPT algorithms
- FR-4
- Author
- Manufacturer
- Date
- Page
- Total pages
- Size page
- A3
- Open Hardware Project
- Materials
- (in symbol Connector_terminal_2pin) Конт.; Цепь
- (in symbol PBD-4) Конт.; Цепь
- (in symbol PBD-6) Конт.; Цепь
- (in symbol PBD-12) Конт.; Цепь

### Library data of the parts
C14 C16 C18 = Ceramic_0805: as C24 on sheet InputCircuitsAndSupply; Package: 0805; HelpURL: https://www.digikey.com/product-detail/en/yageo/CC0805KRX7R7BB104/311-1142-1-ND/303052; Temperature: -55...+125°C
C15 C17 = Ceramic_0805: Manufacturer: Samsung; PartNumber: CL21B106KQQNNNE; ValueManufacturerPartNumber: Ceramic capacitor, 10μF, X7R, ±10%, 6.3V, 0805, -55...+125°C; TypeCapacitor: Ceramic capacitor; Tolerance: ±10%; TypeDielectric: X7R; Package: 0805; HelpURL: https://www.digikey.com/product-detail/en/samsung-electro-mechanics/CL21B106KQQNNNE/1276-1113-1-ND/3889199; Temperature: -55...+125°C
D5 = LDL1117S33R: Linear voltage regulator; Manufacturer: STMicroelectronics; ValueManufacturerPartNumber: Linear voltage regulator, input 3.9...18V, 0.6V, output 3.3V, 1.2A, -40...+85°C, SOT223; VoltageInput: input 3.9...18V; MaxDropout: 0.6V; CurrentOutput: 1.2A; VoltageOutput: output 3.3V; HelpURL: https://www.digikey.com/product-detail/en/stmicroelectronics/LDL1117S33R/497-17239-1-ND/7102079; Package: SOT223; ComponentType: Linear voltage regulator; Temperature: -40...+85°C; PartNumber: LDL1117S33R
D6 = LDL1117S33R: Linear voltage regulator; Manufacturer: STMicroelectronics; ValueManufacturerPartNumber: Linear voltage regulator, input 5.6...18V, 0.6V, output 5V, 1.2A, -40...+85°C, SOT-223; VoltageInput: input 5.6...18V; MaxDropout: 0.6V; CurrentOutput: 1.2A; VoltageOutput: output 5V; HelpURL: https://www.digikey.com/product-detail/en/stmicroelectronics/LDL1117S50R/497-17240-6-ND/7102088; Package: SOT-223; ComponentType: Linear voltage regulator; Temperature: -40...+85°C
D7 = SN65HVD3082EDR: RS485; Manufacturer: Texas Instruments; ValueManufacturerPartNumber: IC RS485 transceiver, 200 kbps, Half-duplex, 4.5...5.5V, -40...+85°C, 8-SOIC; Supply: 4.5...5.5V; DataRate: 200 kbps; TypeDuplex: Half-duplex; HelpURL: https://www.digikey.com/product-detail/en/texas-instruments/SN65HVD3082EDR/296-31719-1-ND/3505195; Package: 8-SOIC; ComponentType: IC RS485 transceiver; Temperature: -40...+85°C; PartNumber: SN65HVD3082EDR
R18-R20 = Resistor_0805: as R25 on sheet InputCircuitsAndSupply; Package: 0805; HelpURL: https://www.digikey.com/product-detail/en/yageo/RC0805JR-07100RL/311-100ARCT-ND/731185; Temperature: -55...+125°C
R21 = Resistor_0805: Manufacturer: Yageo; PartNumber: RC0805JR-07120RL; ValueManufacturerPartNumber: Resistor film, 120R, ±5%, 0805, 0.125W, -55...+125°C; TypeResistor: Resistor film; Power: 0.125W; Package: 0805; HelpURL: https://www.digikey.com/product-detail/en/yageo/RC0805JR-07120RL/311-120ARCT-ND/731194; Temperature: -55...+125°C
R22 = Resistor_0805: as R24 on sheet InputCircuitsAndSupply; Package: 0805; HelpURL: https://www.digikey.com/product-detail/en/yageo/RC0805JR-0710KL/311-10KARCT-ND/731188; Temperature: -55...+125°C
VD3 = TVS_array: Manufacturer: ON Semiconductor; ValueManufacturerPartNumber: TVS diode, 24V, 350W peak, 0.9V, 30pF, SOT-23, -55...+150°C; TypeDiode: TVS diode; Current: 350W peak; VoltageDrop: 0.9V; RecoveryTime: 30pF; Package: SOT-23; HelpURL: https://www.digikey.com/product-detail/en/on-semiconductor/SZNUP2105LT1G/SZNUP2105LT1GOSCT-ND/3487669; Temperature: -55...+150°C
X2 = PBD-12: Manufacturer: Connfly; ValueManufacturerPartNumber: Connector, 12pin, 2.54mm, 500VAC, 3A; TypeConnector: Connector; VoltageMax: 500VAC; Pitch: 2.54mm; CurrentMax: 3A; Multichannel: 12pin; HelpURL: https://www.chipdip.ru/product/pbd-12; PartNumber: PBD-12
X3 = PBD-4: Manufacturer: Connfly; ValueManufacturerPartNumber: Connector, 4pin, 2.54mm, 500VAC, 3A; TypeConnector: Connector; VoltageMax: 500VAC; Pitch: 2.54mm; CurrentMax: 3A; Multichannel: 4pin; HelpURL: https://www.chipdip.ru/product/pbd-4; PartNumber: PBD-4
X4 X9 = Connector_terminal_2pin: Manufacturer: Degson; ValueManufacturerPartNumber: Terminal connector, 2pin, 3.5mm, 300VAC, 10A; PartNumber: DG350-3.5-02P-14; TypeConnector: Terminal connector; VoltageMax: 300VAC; Pitch: 3.5mm; CurrentMax: 10A; Multichannel: 2pin; HelpURL: https://www.chipdip.ru/product/dg350-3.5-02p-12
X5-X8 = PBD-6: Manufacturer: Connfly; ValueManufacturerPartNumber: Connector, 6pin, 2.54mm, 500VAC, 3A; TypeConnector: Connector; VoltageMax: 500VAC; Pitch: 2.54mm; CurrentMax: 3A; Multichannel: 6pin; HelpURL: https://www.chipdip.ru/product/pbd-6; PartNumber: PBD-6

## Nets that join several sheets
GND: InputCircuitsAndSupply (28 pins), BuckAndOutputCircuits. Page 2 (27 pins), InterfaceAndControl (19 pins)
VCC3V3: InputCircuitsAndSupply (6 pins), BuckAndOutputCircuits. Page 2 (5 pins), InterfaceAndControl (C15.2 D5.2 D5.4)
VCC5V: InputCircuitsAndSupply (C26.2 D8.1), BuckAndOutputCircuits. Page 2 (C12.2 D2.1), InterfaceAndControl (5 pins)
VCC12V: InputCircuitsAndSupply (6 pins), BuckAndOutputCircuits. Page 2 (C8.2 D1.5 R1.1), InterfaceAndControl (6 pins)
VCCIN: InputCircuitsAndSupply (7 pins), BuckAndOutputCircuits. Page 2 (VT1.3)
ADC-IIN: InputCircuitsAndSupply (D9.4 D11.3 R26.1 TP7.1), InterfaceAndControl (X7.1)
ADC-IOUT: BuckAndOutputCircuits. Page 2 (D3.4 D4.3 R11.1 TP4.1), InterfaceAndControl (X6.1)
ADC-VIN: InputCircuitsAndSupply (C23.2 R23.2 R27.1 TP8.1), InterfaceAndControl (X7.5)
ADC-VOUT: BuckAndOutputCircuits. Page 2 (C10.2 R8.2 R13.1 TP5.1), InterfaceAndControl (X6.5)
DISABLE: BuckAndOutputCircuits. Page 2 (R12.1), InterfaceAndControl (X7.2)
FAULT: InputCircuitsAndSupply (D12.4 TP11.1), InterfaceAndControl (X6.4)
OCP-OUTPUT: InputCircuitsAndSupply (D12.3), BuckAndOutputCircuits. Page 2 (D4.1)
PWM-CH1: BuckAndOutputCircuits. Page 2 (D1.1 R5.1 TP1.1), InterfaceAndControl (X6.2)
PWM-CH2: BuckAndOutputCircuits. Page 2 (D1.2 R6.1 TP2.1), InterfaceAndControl (X6.6)